# Altium schematic sheet RX5808_TOP.SchDoc
size A4; SheetNumber: 1; SheetTotal: 1
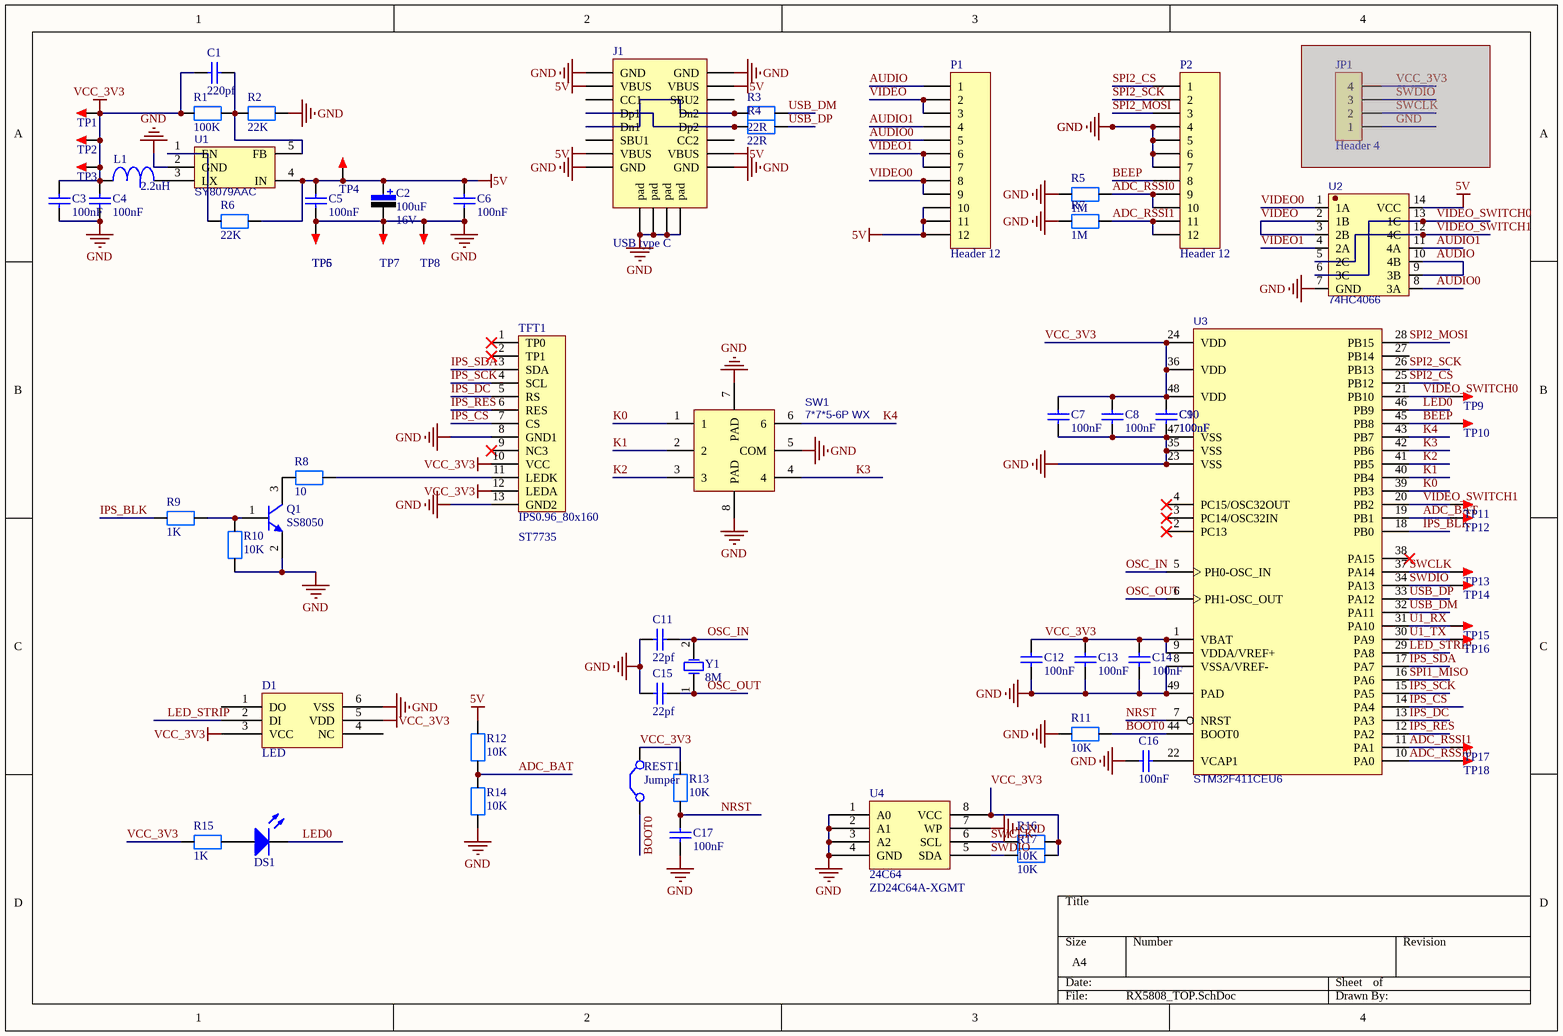
[diagram p0: RX5808_TOP.SchDoc]

## Parts
C1  value 220pf  [0402_CAP]  (hidden comment: Cap)
C2  value 100uF  Vol: 16V  [CAP-3216]  (hidden comment: Cap Pol)
C3  value 100nF  [1206_CAP]  (hidden comment: Cap)
C4  value 100nF  [0402_CAP]  (hidden comment: Cap)
C5  value 100nF  [0402_CAP]  (hidden comment: Cap)
C6  value 100nF  [0402_CAP]  (hidden comment: Cap)
C7  value 100nF  [0402_CAP]  (hidden comment: Cap)
C8  value 100nF  [0402_CAP]  (hidden comment: Cap)
C9  value 100nF  [0402_CAP]  (hidden comment: Cap)
C10  value 100nF  [0402_CAP]  (hidden comment: Cap)
C11  value 22pf  [0402_CAP]  (hidden comment: Cap)
C12  value 100nF  [0402_CAP]  (hidden comment: Cap)
C13  value 100nF  [0402_CAP]  (hidden comment: Cap)
C14  value 100nF  [0402_CAP]  (hidden comment: Cap)
C15  value 22pf  [0402_CAP]  (hidden comment: Cap)
C16  value 100nF  [0402_CAP]  (hidden comment: Cap)
C17  value 100nF  [0402_CAP]  (hidden comment: Cap)
D1  LED  [LED-SMD_6P-L5.0-W5.0-TL]
DS1  LED  [0402_LED]  (value not drawn)
J1  USB type C  [USB-C-SMD_TYPE-C-16M-005]
JP1  Header 4  [SH1.0 S-W-4P]  (masked out: inside a compile mask, not in the netlist)
L1  2.2uH  [L 1206]
P1  Header 12  [HDR1.27-1x12]
P2  Header 12  [HDR1.27-1x12]
Q1  SS8050  [SOT23A]
R1  100K  [0402_RES]
R2  22K  [0402_RES]
R3  22R  [0402_RES]
R4  22R  [0402_RES]
R5  1M  [0402_RES]
R6  22K  [0402_RES]
R7  1M  [0402_RES]
R8  10  [0402_RES]
R9  1K  [0402_RES]
R10  10K  [0402_RES]
R11  10K  [0402_RES]
R12  10K  [0402_RES]
R13  10K  [0402_RES]
R14  10K  [0402_RES]
R15  1K  [0402_RES]
R16  10K  [0402_RES]
R17  10K  [0402_RES]
REST1  Jumper  [SW-SMD_ST-1195]
SW1  7*7*5-6P WX  [SW-SMD_8P-L7.0-W7.0-P1.40-LS7.4-TL]
TFT1  IPS0.96_80x160  [IPS-0.96]
TP1  TEST  [TEST1.0]  (value not drawn)
TP2  TEST  [TEST1.0]  (value not drawn)
TP3  TEST  [TEST1.0]  (value not drawn)
TP4  TEST  [TEST1.0]  (value not drawn)
TP5  TEST  [TEST1.0]  (value not drawn)
TP6  TEST  [TEST1.0]  (value not drawn)
TP7  TEST  [TEST1.0]  (value not drawn)
TP8  TEST  [TEST1.0]  (value not drawn)
TP9  TEST  [TEST1.0]  (value not drawn)
TP10  TEST  [TEST1.0]  (value not drawn)
TP11  TEST  [TEST1.0]  (value not drawn)
TP12  TEST  [TEST1.0]  (value not drawn)
TP13  TEST  [TEST1.0]  (value not drawn)
TP14  TEST  [TEST1.0]  (value not drawn)
TP15  TEST  [TEST1.0]  (value not drawn)
TP16  TEST  [TEST1.0]  (value not drawn)
TP17  TEST  [TEST1.0]  (value not drawn)
TP18  TEST  [TEST1.0]  (value not drawn)
U1  SY8079AAC  [SOT-23-5_L3.0-W1.7-P0.95-LS2.8-TL]
U2  74HC4066  [SSOP-14_L6.5-W5.2-P0.65-LS8.0-BL]
U3  STM32F411CEU6  [UFQFPN-48_L7.0-W7.0-P0.50-BL-EP]
U4  24C64  [TSSOP-8_L4.4-W3.0-P0.65-LS6.4-BL-2]
Y1  8M  [CSTCE8M00G55]

## Nets
5V: C2.1 C5.2 C6.2 J1.A4(VBUS) J1.A9(VBUS) J1.B4(VBUS) J1.B9(VBUS) P1.10 P1.11 P1.12 R6.1 R12.2 TP4.1 U1.4(IN) U2.14(VCC)
GND: C2.2 C3.1 C4.1 C5.1 C6.1 C7.2 C8.2 C9.2 C10.2 C11.1 C12.2 C13.2 C14.2 C15.1 C16.2 C17.2 D1.6(VSS) J1.1(pad) J1.A1(GND) J1.A12(GND) J1.B1(GND) J1.B12(GND) P2.4 P2.5 P2.6 P2.7 Q1.2(E) R2.1 R5.2 R7.2 R10.2 R11.2 R14.1 SW1.5(COM) SW1.7(PAD) SW1.8(PAD) TFT1.8(GND1) TFT1.13(GND2) TP5.1 TP6.1 TP7.1 TP8.1 U1.2(GND) U2.7(GND) U3.8(VSSA/VREF-) U3.23(VSS) U3.35(VSS) U3.47(VSS) U3.49(PAD) U4.1(A0) U4.2(A1) U4.3(A2) U4.4(GND) U4.7(WP)
VCC_3V3: C1.1 C3.2 C4.2 C7.1 C8.1 C9.1 C10.1 C12.1 C13.1 C14.1 D1.3(VCC) D1.5(VDD) L1.1 R1.2 R13.2 R15.2 R16.1 R17.1 REST1.2(C2) TFT1.10(VCC) TFT1.12(LEDA) TP1.1 TP2.1 TP3.1 U3.1(VBAT) U3.9(VDDA/VREF+) U3.24(VDD) U3.36(VDD) U3.48(VDD) U4.8(VCC)
ADC_BAT: R12.1 R14.2 TP12.1 U3.19(PB1)
ADC_RSSI0: P2.9 P2.10 R5.1 TP18.1 U3.10(PA0)
ADC_RSSI1: P2.11 P2.12 R7.1 TP17.1 U3.11(PA1)
AUDIO: P1.1 U2.9(3B) U2.10(4B)
AUDIO0: P1.5 U2.8(3A)
AUDIO1: P1.4 U2.11(4A)
BEEP: P2.8 TP10.1 U3.45(PB8)
BOOT0: R11.1 REST1.1(C1) U3.44(BOOT0)
IPS_BLK: R9.1 U3.18(PB0)
IPS_CS: TFT1.7(CS) U3.14(PA4)
IPS_DC: TFT1.5(RS) U3.13(PA3)
IPS_RES: TFT1.6(RES) U3.12(PA2)
IPS_SCK: TFT1.4(SCL) U3.15(PA5)
IPS_SDA: TFT1.3(SDA) U3.17(PA7)
K0: SW1.1 U3.39(PB3)
K1: SW1.2 U3.40(PB4)
K2: SW1.3 U3.41(PB5)
K3: SW1.4 U3.42(PB6)
K4: SW1.6 U3.43(PB7)
LED0: DS1.2(K) U3.46(PB9)
LED_STRIP: D1.2(DI) U3.29(PA8)
NRST: C17.1 R13.1 U3.7(NRST)
OSC_IN: C11.2 U3.5(PH0-OSC_IN) Y1.2(OSC2)
OSC_OUT: C15.2 U3.6(PH1-OSC_OUT) Y1.1(OSC1)
SPI1_MISO: U3.16(PA6)
SPI2_CS: P2.1 U3.25(PB12)
SPI2_MOSI: P2.3 U3.28(PB15)
SPI2_SCK: P2.2 U3.26(PB13)
SWCLK: R16.2 TP13.1 U3.37(PA14) U4.6(SCL)
SWDIO: R17.2 TP14.1 U3.34(PA13) U4.5(SDA)
U1_RX: TP15.1 U3.31(PA10)
U1_TX: TP16.1 U3.30(PA9)
USB_DM: R3.2 U3.32(PA11)
USB_DP: R4.2 U3.33(PA12)
VIDEO: P1.2 P1.3 U2.2(1B) U2.3(2B)
VIDEO0: P1.8 P1.9 U2.1(1A)
VIDEO1: P1.6 P1.7 U2.4(2A)
VIDEO_SWITCH0: TP9.1 U2.6(3C) U2.13(1C) U3.21(PB10)
VIDEO_SWITCH1: TP11.1 U2.5(2C) U2.12(4C) U3.20(PB2)
NetC1_2: C1.2 R1.1 R2.2 U1.5(FB)
NetC16_1: C16.1 U3.22(VCAP1)
NetDS1_1: DS1.1(A) R15.1
NetJ1_A6: J1.A6(Dp1) J1.B6(Dp2) R4.1
NetJ1_A7: J1.A7(Dn1) J1.B7(Dn2) R3.1
NetL1_2: L1.2 U1.3(LX)
NetQ1_1: Q1.1(B) R9.2 R10.1
NetQ1_3: Q1.3(C) R8.1
NetR6_2: R6.2 U1.1(EN)
NetR8_2: R8.2 TFT1.11(LEDK)

Not connected (* = marked no-connect by the designer): D1 1(DO) 4(NC); J1 A5(CC1) A8(SBU1) B5(CC2) B8(SBU2); TFT1 1(TP0)* 2(TP1)* 9(NC3)*; U3 2(PC13)* 3(PC14/OSC32IN)* 4(PC15/OSC32OUT)* 27(PB14) 38(PA15)*

## Notes on the sheet
- (near TFT1) ST7735
- (near U4) ZD24C64A-XGMT

## Library data of the parts
C1 C3-C17 = Cap: 无极性电容; Published: 8-Jun-2000; LatestRevisionDate: 17-Jul-2002; LatestRevisionNote: Re-released for DXP Platform.; PackageReference: RAD-0.3; Publisher: Altium Limited
C2 = Cap Pol: 极性电解电容; Published: 8-Jun-2000; LatestRevisionDate: 17-Jul-2002; LatestRevisionNote: Re-released for DXP Platform.; PackageReference: RB7.6-15; Publisher: Altium Limited
D1 = WS2812
J1 = Type-C: TYPEC接口-16PIN
JP1 = Header 4: 4P接插件; 版权归属: 源创客; BOM名称: 4P接插件; 学习资源: www.ooocke.com
L1 = Inductance: 电感
P1 P2 = Header 12: Header, 12-Pin; LatestRevisionDate: 17-Jul-2002; LatestRevisionNote: Re-released for DXP Platform.; Publisher: Altium Limited
Q1 = SS8050: NPN三极管
R1-R17 = RES: 电阻
REST1 = Jumper: 按键; Published: 24-Mar-1999; LatestRevisionDate: 17-Jul-2002; LatestRevisionNote: Re-released for DXP Platform.; PackageReference: RAD-0.2; Publisher: Altium Limited
SW1 = 7*7*5-6P WX: 五向按键; BOM_Manufacturer: SHOU HAN(首韩); Contributor: LCSC; BOM_Supplier: LCSC; BOM_Supplier Part: C2858286; BOM_Manufacturer Part: 7*7*5-6P WX; BOM_JLCPCB Part Class: Extended Part; spicePre: S; spiceSymbolName: 7*7*5-6P WX
TFT1 = IPS0.96_80x160: IPS-135x240; BOM名称: 1.44寸TFT屏; 版权归属: 源创客; 学习资源: www.ooocke.com
TP1-TP18 = TEST: 测试点; 版权归属: 源创客; BOM名称: 测试点; 学习资源: www.ooocke.com
U1 = SY8079AAC: BOM_Manufacturer: Silergy; BOM_Supplier: LCSC; BOM_Manufacturer Part: SY8079AAC; BOM_Supplier Part: C133751; BOM_JLCPCB Part Class: Extended Part; spicePre: U; spiceSymbolName: SY8079AAC
U2 = SN74HC4066DBR: BOM_Manufacturer: TI; spicePre: X; BOM_Supplier: LCSC; BOM_Manufacturer Part: SN74HC4066DBR; BOM_Supplier Part: C6849; BOM_JLCPCB Part Class: Extended Part; spiceSymbolName: SN74HC4066DBR
U3 = STM32F411CEU6: BOM_Manufacturer: STMicroelectronics; BOM_Supplier: LCSC; BOM_Manufacturer Part: STM32F411CEU6; BOM_Supplier Part: C60420; BOM_JLCPCB Part Class: Extended Part; spicePre: U; spiceSymbolName: STM32F411CEU6
U4 = 24C02: E2PROM
Y1 = XTAL_1: XTAL